# Altium schematic sheet MP3.SchDoc
size A3
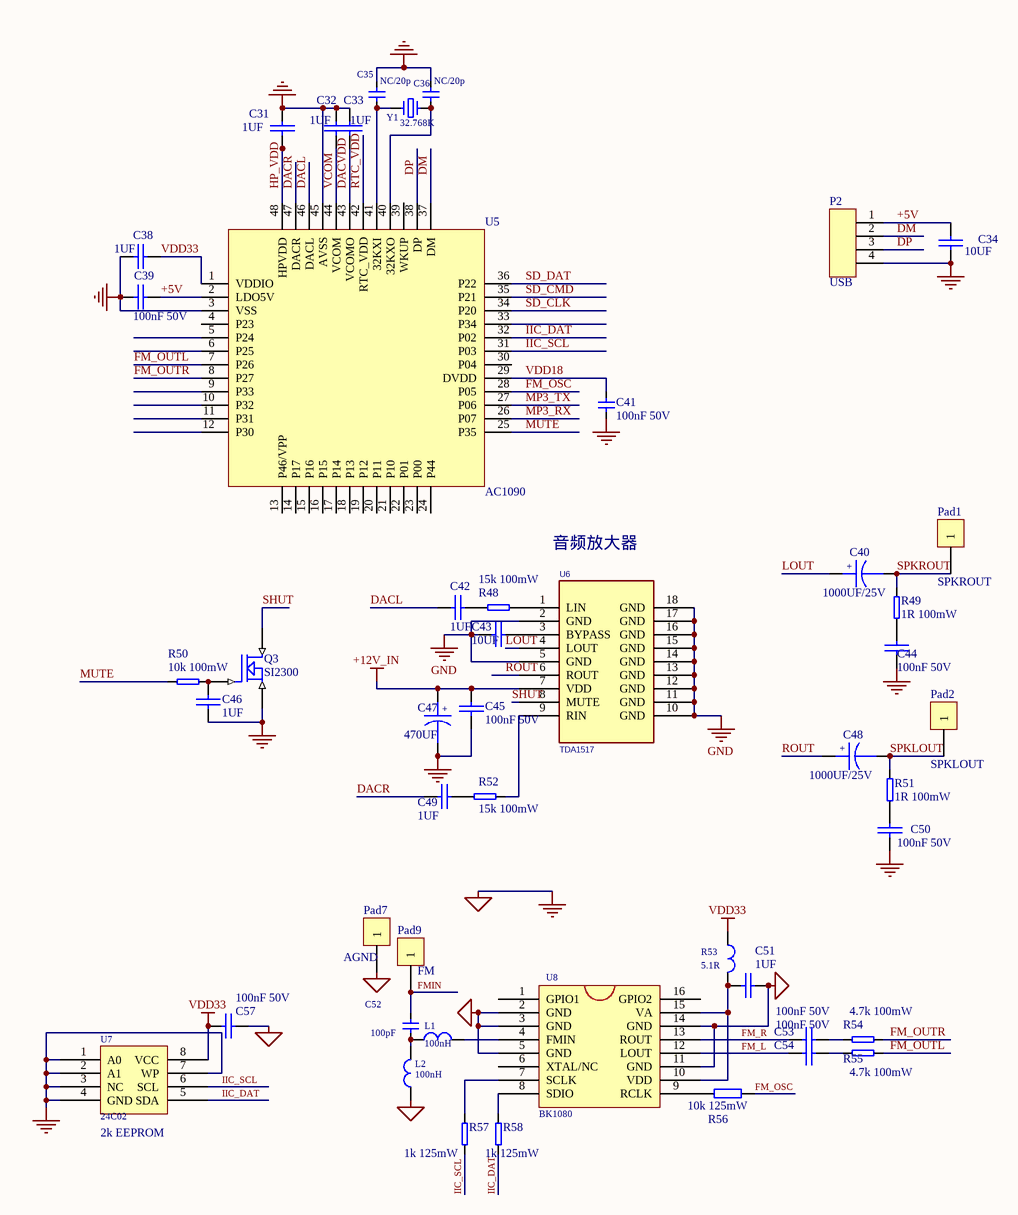
[diagram p0: MP3.SchDoc]

## Parts
C31  1UF  [0805]
C32  1UF  [0805]
C33  1UF  [0805]
C34  10UF  [0805]
C35  NC/20p  [0603]
C36  NC/20p  [0603]
C38  1UF  [0805]
C39  100nF 50V  [0805]
C40  1000UF/25V  [RB.2.4]
C41  100nF 50V  [0603]
C42  1UF  [0805]
C43  10UF  [0805]
C44  100nF 50V  [0805]
C45  100nF 50V  [0805]
C46  1UF  [0805]
C47  470UF  [RB.2/.4]
C48  1000UF/25V  [RB.2.4]
C49  1UF  [0805]
C50  100nF 50V  [0805]
C51  1UF  [0805]
C52  100pF  [0603]
C53  100nF 50V  [0805]
C54  100nF 50V  [0805]
C57  100nF 50V  [0805]
L1  100nH  [0603]
L2  100nH  [0603]
P2  USB  [SIP4]
Pad1  SPKROUT  [PAD]
Pad2  SPKLOUT  [PAD]
Pad7  AGND  [PAD]
Pad9  FM  [PAD]
Q3  SI2300  [SOT-23]
R48  15k 100mW  [0603]
R49  1R 100mW  [0603]
R50  10k 100mW  [0603]
R51  1R 100mW  [0603]
R52  15k 100mW  [0603]
R53  5.1R  [0603]
R54  4.7k 100mW  [0603]
R55  4.7k 100mW  [0603]
R56  10k 125mW  [0805]
R57  1k 125mW  [0805]
R58  1k 125mW  [0805]
U5  AC1090  [TQFP48 7X7]
U6  TDA1517  [DIP18]
U7  24C02  [SO-8]
U8  BK1080  [SOP-16]
Y1  32.768K  [Cry3215]

## Nets
+12V_IN: C45.2 C47.1 U6.7(VDD)
AGND: C31.1 C32.1 C33.1 C34.2 C35.2 C36.2 C38.2 C39.1 C41.2 C43.1 C44.2 C45.1 C46.1 C47.2 C50.2 C51.1 C57.2 L2.1 P2.4 Pad7.1 Q3.3(S) U5.3(VSS) U5.45(AVSS) U6.2(GND) U6.5(GND) U6.10(GND) U6.11(GND) U6.12(GND) U6.13(GND) U6.14(GND) U6.15(GND) U6.16(GND) U6.17(GND) U6.18(GND) U7.1(A0) U7.2(A1) U7.3(NC) U7.4(GND) U7.7(WP) U8.2(GND) U8.3(GND) U8.5(GND) U8.11(GND) U8.14(GND)  [also labelled GND]
VDD33: C38.1 C57.1 R53.1 U5.1(VDDIO) U7.8(VCC)
+5V: C34.1 C39.2 P2.1 U5.2(LDO5V)
DACL: C42.2 U5.46(DACL)
DACR: C49.2 U5.47(DACR)
DACVDD: C33.2 U5.43(VCOMO)
DM: P2.2 U5.37(DM)
DP: P2.3 U5.38(DP)
FM_L: C54.1 U8.12(LOUT)
FM_OSC: R56.1 U5.28(P05)
FM_OUTL: R55.2 U5.7(P26)
FM_OUTR: R54.2 U5.8(P27)
FM_R: C53.1 U8.13(ROUT)
FMIN: C52.1 Pad9.1
HP_VDD: C31.2 U5.48(HPVDD)
IIC_DAT: R58.1 U5.32(P02) U7.5(SDA)
IIC_SCL: R57.1 U5.31(P03) U7.6(SCL)
LOUT: C40.1 U6.4(LOUT)
MP3_RX: U5.26(P07)
MP3_TX: U5.27(P06)
MUTE: R50.1 U5.25(P35)
ROUT: C48.1 U6.6(ROUT)
RTC_VDD: U5.42(RTC_VDD)
SD_CLK: U5.34(P20)
SD_CMD: U5.35(P21)
SD_DAT: U5.36(P22)
SHUT: Q3.2(D) U6.8(MUTE)
SPKLOUT: C48.2 Pad2.1 R51.2
SPKROUT: C40.2 Pad1.1 R49.2
VCOM: C32.2 U5.44(VCOM)
VDD18: C41.1 U5.29(DVDD)
NetC35_1: C35.1 U5.41(32KXI) Y1.2
NetC36_1: C36.1 U5.40(32KXO) Y1.1
NetC42_1: C42.1 R48.1
NetC43_2: C43.2 U6.3(BYPASS)
NetC44_1: C44.1 R49.1
NetC46_2: C46.2 Q3.1(G) R50.2
NetC49_1: C49.1 R52.1
NetC50_1: C50.1 R51.1
NetC51_2: C51.2 R53.2 U8.10(VDD) U8.15(VA)
NetC52_2: C52.2 L1.1 L2.2
NetC53_2: C53.2 R54.1
NetC54_2: C54.2 R55.1
NetL1_2: L1.2 U8.4(FMIN)
NetR48_2: R48.2 U6.1(LIN)
NetR52_2: R52.2 U6.9(RIN)
NetR56_2: R56.2 U8.9(RCLK)
NetR57_2: R57.2 U8.7(SCLK)
NetR58_2: R58.2 U8.8(SDIO)

Not connected (* = marked no-connect by the designer): U5 4(P23) 5(P24) 6(P25) 9(P33) 10(P32) 11(P31) 12(P30) 13(P46/VPP) 14(P17) 15(P16) 16(P15) 17(P14) 18(P13) 19(P12) 20(P11) 21(P10) 22(P01) 23(P00) 24(P44) 30(P04) 33(P34) 39(WKUP); U8 1(GPIO1) 6(XTAL/NC) 16(GPIO2)

## Notes on the sheet
- 音频放大器
- (near U7) 2k EEPROM
- (in symbol CAPACITOR POL) +

## Library data of the parts
C31-C36 C38 C39 C41 C42 C44-C46 C49-C54 C57 = CAP: Capacitor
C40 C47 C48 = CAPACITOR POL: Capacitor
C43 = CAP_1: Capacitor
L1 L2 R53 = INDUCTOR
P2 = CON4
Pad1 Pad2 Pad7 Pad9 = CON1: Connector
Q3 = MOSFET N
R48-R52 R54 R55 R57 R58 = RES2_1
R56 = WHLRES
U6 = 74HC245_0
U7 = EEPROM-8
U8 = BK1080: Part Field 1: FM收音芯片
Y1 = CRYSTAL